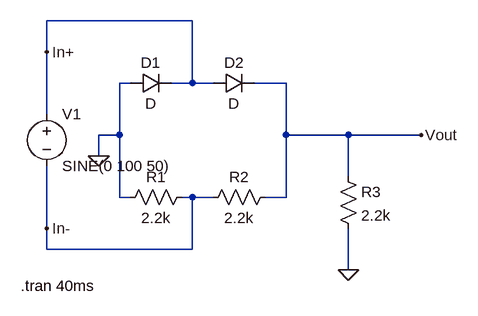
[diagram p0: schematic Assignment 3.2 Diode Application.asc]
Assignment 3.2 Diode Application.asc, the LTspice schematic file:
Version 4.1
SHEET 1 880 680
WIRE 224 -16 0 -16
WIRE 0 32 0 -16
WIRE 128 80 112 80
WIRE 224 80 224 -16
WIRE 224 80 192 80
WIRE 256 80 224 80
WIRE 368 80 320 80
WIRE 0 128 0 32
WIRE 112 160 112 80
WIRE 112 160 80 160
WIRE 368 160 368 80
WIRE 464 160 368 160
WIRE 576 160 464 160
WIRE 80 192 80 160
WIRE 464 224 464 160
WIRE 112 256 112 160
WIRE 128 256 112 256
WIRE 224 256 208 256
WIRE 256 256 224 256
WIRE 368 256 368 160
WIRE 368 256 336 256
WIRE 0 304 0 208
WIRE 0 336 0 304
WIRE 224 336 224 256
WIRE 224 336 0 336
WIRE 464 368 464 304
FLAG 464 368 0
FLAG 80 192 0
FLAG 0 32 In+
FLAG 576 160 Vout
FLAG 0 304 In-
SYMBOL voltage 0 112 R0
WINDOW 123 0 0 Left 0
WINDOW 39 0 0 Left 0
SYMATTR InstName V1
SYMATTR Value SINE(0 100 50)
SYMBOL diode 128 96 R270
WINDOW 0 32 32 VTop 2
WINDOW 3 0 32 VBottom 2
SYMATTR InstName D1
SYMBOL diode 256 96 R270
WINDOW 0 32 32 VTop 2
WINDOW 3 0 32 VBottom 2
SYMATTR InstName D2
SYMBOL res 224 240 R90
WINDOW 0 0 56 VBottom 2
WINDOW 3 32 56 VTop 2
SYMATTR InstName R1
SYMATTR Value 2.2k
SYMBOL res 352 240 R90
WINDOW 0 0 56 VBottom 2
WINDOW 3 32 56 VTop 2
SYMATTR InstName R2
SYMATTR Value 2.2k
SYMBOL res 448 208 R0
SYMATTR InstName R3
SYMATTR Value 2.2k
TEXT -40 392 Left 2 !.tran 40ms

The netlist it stands for:
* Assignment 3.2 Diode Application.asc
V1 In+ In- SINE(0 100 50)
D1 0 In+ D
D2 In+ Vout D
R1 In- 0 2.2k
R2 Vout In- 2.2k
R3 Vout 0 2.2k
.model D D
.lib standard.dio
.tran 40ms
.backanno
.end